# EAGLE design switcher (EAGLE 5.09)
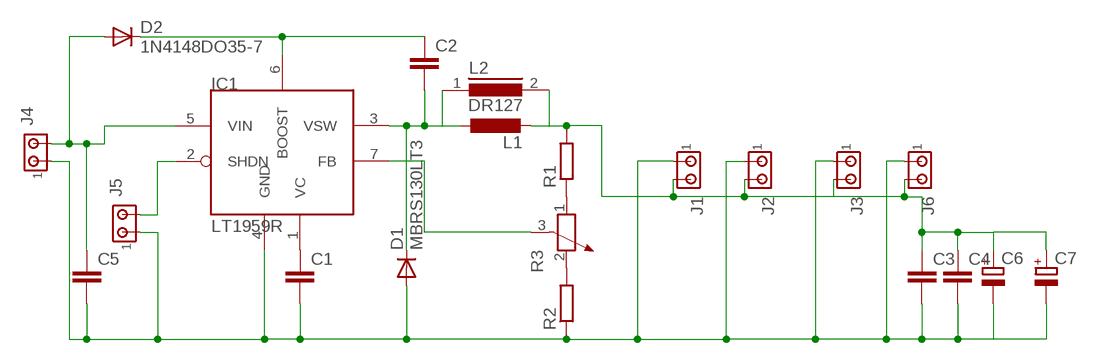
[diagram p0: schematic, sheet 1]

## Parts
C1  C-EUC0805  [C0805]
C2  C-EUC0805  [C0805]
C3  C-EUC2220K  [C2220K]
C4  C-EUC2220K  [C2220K]
C5  C-EUC2220K  [C2220K]
C6  CPOL-EUD/7343-31R  [D/7343-31R]
C7  CPOL-EUD/7343-31R  [D/7343-31R]
D1  MBRS130LT3  DIODE-C2673  [C2673]
D2  1N4148DO35-7  [DO35-7]
IC1  LT1959R  [DDPACK-7]
J1  MTA02-100  [10X02MTA]
J2  MTA02-100  [10X02MTA]
J3  MTA02-100  [10X02MTA]
J4  MTA02-100  [10X02MTA]
J5  MTA02-100  [10X02MTA]
J6  MTA02-100  [10X02MTA]
L1  L-EUWE-TPC  [POWER-CHOKE_WE-TPC]
L2  DR127  [DR127]
R1  R-EU_R0805  [R0805]
R2  R-EU_R0805  [R0805]
R3  POTENTIOMETER_PT-10  [PT-10]

## Nets
GND: C1.2 C3.2 C4.2 C5.2 C6.- C7.- D1.A IC1.4(GND) J1.1 J2.1 J3.1 J4.1 J5.1 J6.1 R2.1
N$1: C1.1 IC1.1(VC)
N$2: R1.1 R3.1
N$3: R2.2 R3.2
N$4: IC1.7(FB) R3.3
N$8: C2.1 D2.C IC1.6(BOOST)
N$11: C3.1 C4.1 C6.+ C7.+ J1.2 J2.2 J3.2 J6.2 L1.2 L2.2 R1.2
N$13: IC1.2(SHDN) J5.2
N$14: C5.1 D2.A IC1.5(VIN) J4.2
N$21: C2.2 D1.C IC1.3(VSW) L1.1 L2.1

## Library data of the parts
C1-C5 = rcl:C-EU: CAPACITOR, European symbol
C6 C7 = rcl:CPOL-EU: POLARIZED CAPACITOR, European symbol
D1 = diode:DIODE-: DIODE
D2 = diode:1N4148: DIODE high speed (Philips)
IC1 = Mine:LT1959
J1-J6 = con-amp:MTA02-100: AMP connector
L1 = rcl:L-EU: INDUCTOR, European symbol
L2 = inductors:DR127: High Power Density, High Efficiency, Shielded Inductors Source: coiltronics_dr_series.pdf
R1 R2 = rcl:R-EU_: RESISTOR, European symbol
R3 = rcl:POTENTIOMETER_: Potentiometer

## Board
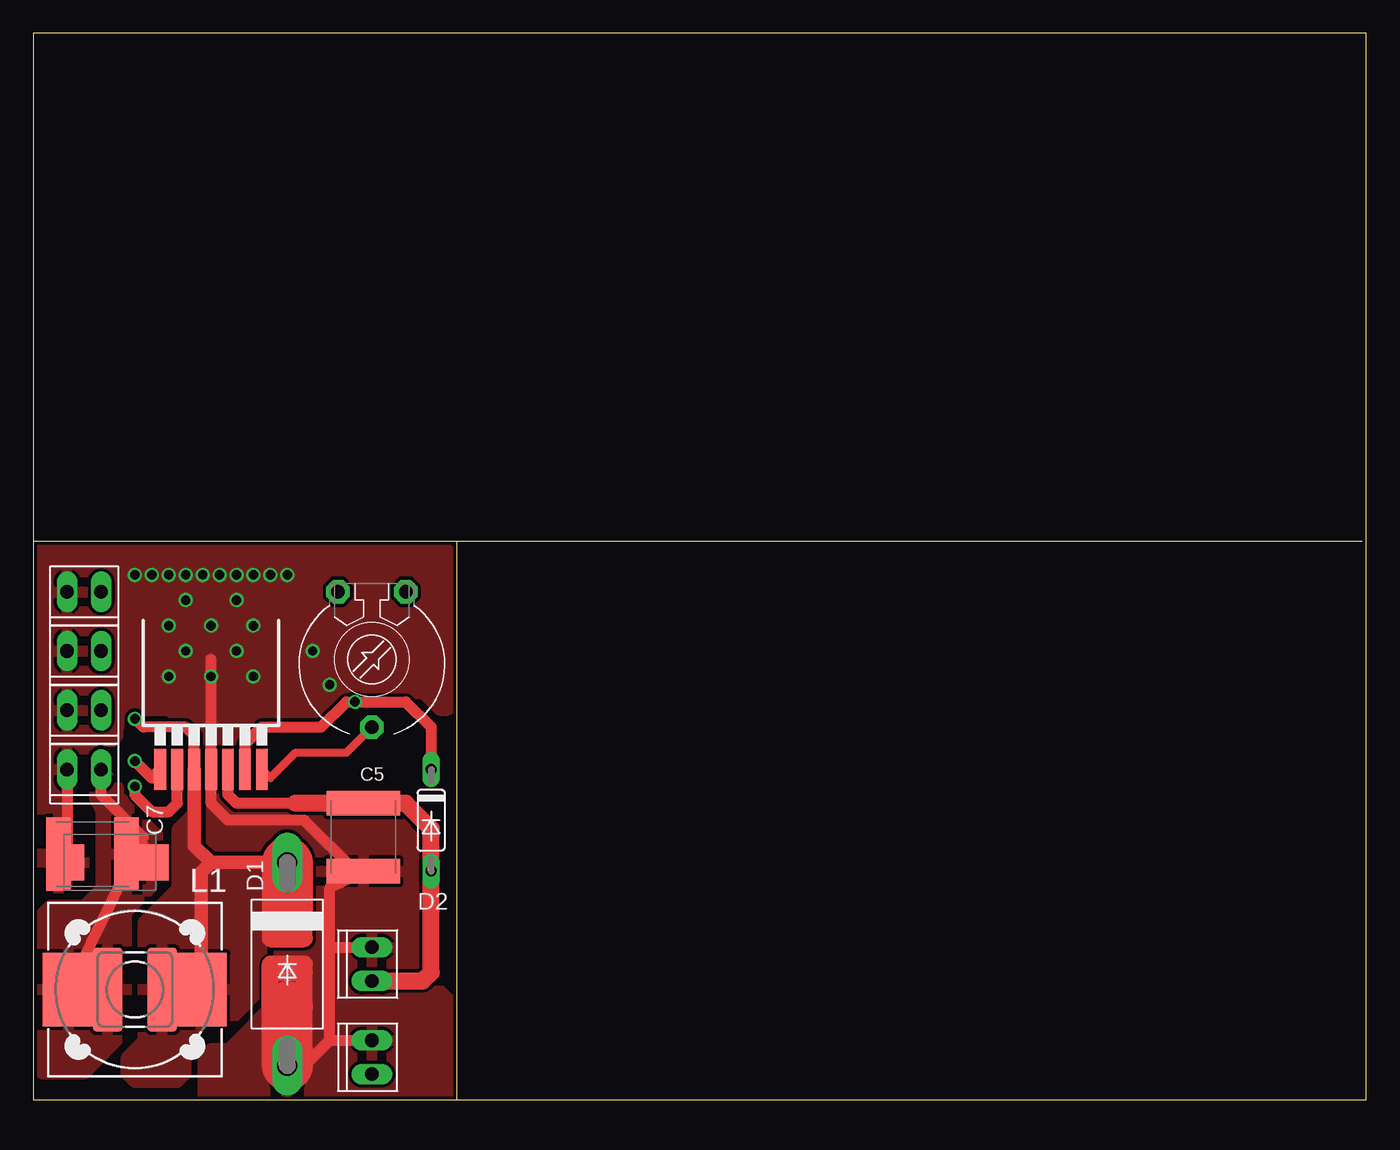
[diagram p1: board, top side]
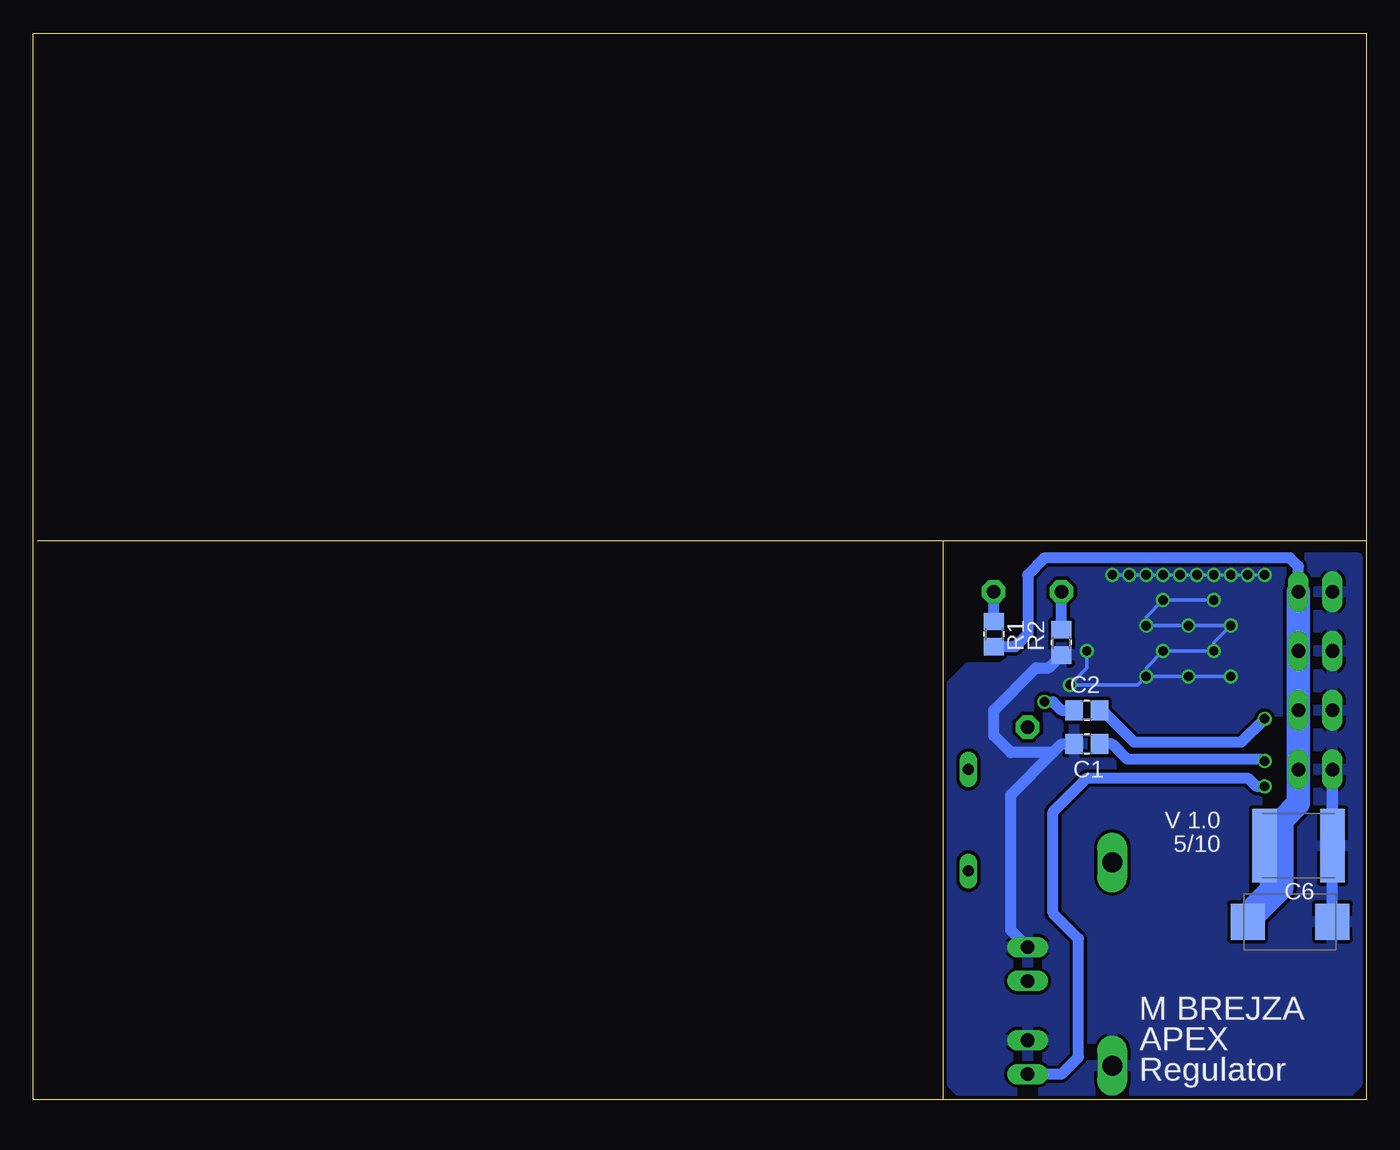
[diagram p2: board, bottom side, seen from below]

Size 100 x 80 mm. Coordinates in mm from the lower left corner, seen from the top.
Outline: 31.75,0 0,0 0,41.91
Outline: 31.75,0 100,0 100,80 0,80 0,41.91
Outline: 31.75,41.91 99.69,41.91
Outline: 0,41.91 31.75,41.91
Outline: 31.75,41.91 31.75,0
Copper layers (1*16): Top 0.035mm / dielectric 1.5mm / Bottom 0.035mm
Design rules "Fusion_eagle_rule_v1.1": minimum track width 6mil, minimum drill 12mil, track to track 6mil, track to pad 6mil, pad to pad 6mil, via to via 6mil, smd to smd 0mil, copper to edge 10mil, drill to drill 10mil, minimum pad ring 10mil, minimum via ring 6mil, stop-mask expansion 2mil, vias tented up to drill 100mil, thermal gap 10mil

### Footprints (pad centres in the part's own frame; a part is rotated, then mirrored left to right if it is on the bottom)
C0805 = smd 1.3 x 1.5: 1 -0.95,0; 2 0.95,0
C2220K = smd 1.85 x 5.5: 1 -2.55,0; 2 2.55,0
D/7343-31R = smd 2.55 x 2.7: + 3.175,0; - -3.175,0
C2673 = drill 1.499 long: A 7.62,0; C -7.62,0
DO35-7 = drill 0.813 long: A 3.81,0; C -3.81,0
DDPACK-7 = smd 0.889 x 3.048: 1 -3.81,-8.255; 2 -2.54,-8.255; 3 -1.27,-8.255; 4 0,-8.255; 5 1.27,-8.255; 6 2.54,-8.255; 7 3.81,-8.255
10X02MTA = drill 1.016 long: 1 1.27,0; 2 -1.27,0
POWER-CHOKE_WE-TPC = smd 6.3 x 2.2: 1 0,2.05; 2 0,-2.05
DR127 = smd 3.85 x 5.5: 1 -4.975,0; 2 4.975,0
R0805 = smd 1.3 x 1.5: 1 -0.95,0; 2 0.95,0
PT-10 = drill 1.016 pad 1.778 octagon: 1 -2.54,-5.08; 2 2.54,-5.08; 3 0,5.08

### Placement (x,y rotation side)
C1  20.95,26.67 180 bottom
C2  20.95,29.21 0 bottom
C3  5.08,19.05 0 bottom
C4  4.45,18.41 180 top
C5  24.77,19.68 270 top
C6  5.71,13.34 180 bottom
C7  5.71,17.78 0 top
D1  19.05,10.16 270 top
D2  29.84,20.95 270 top
IC1  13.34,33.02 0 top
J1  3.81,38.1 180 top
J2  3.81,29.21 180 top
J3  3.81,24.77 180 top
J4  25.4,10.16 90 top
J5  25.4,3.17 90 top
J6  3.81,33.66 180 top
L1  7.62,8.26 270 top
L2  7.62,8.26 180 top
R1  27.94,34.92 270 bottom
R2  22.86,34.29 90 bottom
R3  25.4,33.02 180 top

### Tracks (layer width: path | path; a pad name or v marks a point on that pad's centre or on a via)
GND  (via drill 0.7)
  Top 0.813: J3.1 C7.- C4.2 | 22.99,16.26 22.23,15.88 22.23,14.61 22.23,11.43 | 22.99,16.26 C5.2 | 22.23,4.45 22.23,11.43 | 22.23,4.45 20.32,2.54 D1.A | 22.23,4.45 J5.1 | 22.23,11.43 J4.1 | 13.34,33.02 v13.34,31.75 IC1.4 13.34,22.23 14.61,20.95 20.32,20.95 24.13,17.14 22.86,16.38 22.99,16.26
  Top 1.27: 17.78,9.53 17.78,3.17 18.41,2.54 D1.A 20.32,3.81 20.32,9.53 | 20.32,9.53 17.78,9.53 | 17.78,9.53 17.78,10.16 20.32,10.16 20.32,9.53
  Top 3.81: D1.A 19.05,6.99
  Bottom 0.254: v7.62,39.37 v8.89,39.37 v10.16,39.37 v11.43,39.37 v12.7,39.37 v13.97,39.37 v15.24,39.37 v16.51,39.37 v17.78,39.37 v19.05,39.37 | v10.16,31.75 v13.34,31.75 v16.51,31.75 | v16.51,31.75 16.51,32.38 v15.24,33.66 v11.43,33.66 11.43,34.29 v10.16,35.56 v13.34,35.56 v16.51,35.56 16.51,36.2 v15.24,37.47 v11.43,37.47 | v20.95,33.66 20.95,32.38 v22.23,31.11 17.14,31.11 v16.51,31.75
  Bottom 0.813: C6.- 2.54,24.13 | 2.54,24.13 J3.1 | C3.2 2.53,24.12 2.54,24.13 | 23.5,26.04 22.86,26.67 C1.2 | 23.5,26.04 26.67,26.04 27.94,27.3 27.94,29.21 24.77,32.38 23.82,32.38 R2.1 | 23.5,26.04 26.67,22.86 26.67,12.7 J4.1
  pour Top (isolate 0.254): 13.34,23.5 13.34,19.05 20.95,19.05 20.95,15.24 18.41,12.7 18.41,7.62 14.61,3.81 13.34,3.81 12.7,3.17 12.7,0 31.11,0 31.75,0.64 31.75,6.99 29.21,9.53 29.21,19.05 27.94,20.32 27.94,20.95 26.67,22.23 15.88,22.23 14.61,23.5
  pour Top (isolate 0.254): 13.97,26.67 15.88,26.67 17.14,27.94 21.59,27.94 24.13,30.48 29.21,30.48 30.48,29.21 31.11,29.21 31.75,29.84 31.75,40.64 31.11,41.27 30.48,41.91 0.64,41.91 0,41.27 0,17.14 1.27,15.88 3.17,15.88 3.81,16.51 3.81,20.32 3.17,20.95 2.54,20.95 2.54,25.4 3.17,26.04 5.08,26.04 6.35,27.3 6.35,27.94 7.62,29.21 10.16,29.21 12.7,26.67
  pour Bottom (isolate 0.254): 14.61,40.64 24.13,40.64 25.4,39.37 25.4,34.29 27.3,32.38 29.84,32.38 31.11,31.11 31.11,1.27 30.48,0.64 1.27,0.64 0.64,1.27 0.64,40.64
N$1  (via drill 0.7)
  Top 0.813: IC1.1 8.89,24.13 v7.62,25.4
  Bottom 0.813: C1.1 19.05,26.67 17.91,25.53 7.75,25.53 v7.62,25.4
N$2
  Bottom 0.813: R1.1 R3.1
N$3
  Bottom 0.813: R2.2 R3.2
N$4
  Top 0.61: IC1.7 17.78,24.13 19.68,26.04 23.5,26.04 R3.3
N$8  (via drill 0.7)
  Top 0.813: IC1.6 15.88,26.67 17.14,27.94 21.59,27.94 23.5,29.84 v24.13,29.84 27.94,29.84 29.84,27.94 D2.C
  Bottom 0.813: C2.1 22.86,29.21 23.5,29.84 v24.13,29.84
N$11
  Top 0.813: C4.1 7.62,18.41 L2.2 L1.2 | C4.1 7.63,20.31 | J3.2 5.08,22.86 8.26,19.68 C4.1 | C7.+ 8.27,19.05 C4.1
  Bottom 0.813: C6.+ 8.89,14.61 7.62,15.88 C3.1 5.08,21.59 5.08,22.23 | R1.2 26.35,33.98 25.4,34.92 25.4,39.37 24.13,40.64 5.71,40.64 5.08,40.01 J1.2
  Bottom 1.778: C6.+ 6.35,15.88 6.35,20.95 5.08,22.23 J3.2 J2.2 J6.2 J1.2
  pour Top: 0.64,1.91 0.64,13.97 1.27,14.61 3.81,14.61 5.08,15.88 5.08,21.59 4.45,22.86 4.45,23.5 5.08,24.77 6.35,23.5 6.35,22.86 9.53,19.68 9.53,16.51 6.99,13.97 6.99,5.08 3.81,1.91
N$13  (via drill 0.7)
  Top 0.813: v7.62,23.5 7.62,22.86 8.89,21.59 10.16,21.59 10.79,22.23 IC1.2
  Bottom 0.813: 24.77,1.91 J5.2 22.86,1.91 21.59,3.17 21.59,12.06 23.5,13.97 23.5,21.59 20.95,24.13 8.89,24.13 8.26,23.5 v7.62,23.5
N$14
  Top 0.813: 19.68,22.23 19.05,22.23 15.24,22.23 14.61,22.86 IC1.5 | C5.1
  Top 1.27: C5.1 19.68,22.23 | J4.2 29.21,8.89 29.84,9.53 D2.A 29.84,20.32 27.94,22.23 C5.1
N$21  (via drill 0.7)
  Top 0.813: IC1.3 12.06,27.3 11.43,27.94 8.26,27.94 v7.62,28.57 | L1.1 L2.1
  Top 1.016: IC1.3 12.06,19.05 13.34,17.78 | 13.34,17.78 D1.C | L2.1 12.6,17.04 13.34,17.78
  Top 1.27: 20.32,14.61 20.32,12.06 17.78,12.06 17.78,16.51 D1.C
  Top 3.81: D1.C 19.05,13.34
  Bottom 0.813: C2.2 19.81,29.21 17.4,26.8 9.4,26.8 v7.62,28.57
  pour Top: 12.06,17.78 19.05,17.78 19.05,15.24 17.14,13.34 17.14,8.26 14.61,5.71 12.7,5.71 11.43,4.45 11.43,1.91 10.79,1.27 7.62,1.27 6.99,1.91 6.99,3.17 8.26,4.45 8.26,13.34 10.79,15.88 10.79,20.32 12.06,21.59

### Text on the board
_tsilk: - | + | Vadj | Vout | - | PWR | + | - | EN
_bsilk: V 1.0 | 5/10 | M BREJZA | APEX | Regulator